# Altium schematic sheet USB-Connection.SchDoc
size A; SheetNumber: 7; SheetTotal: 8
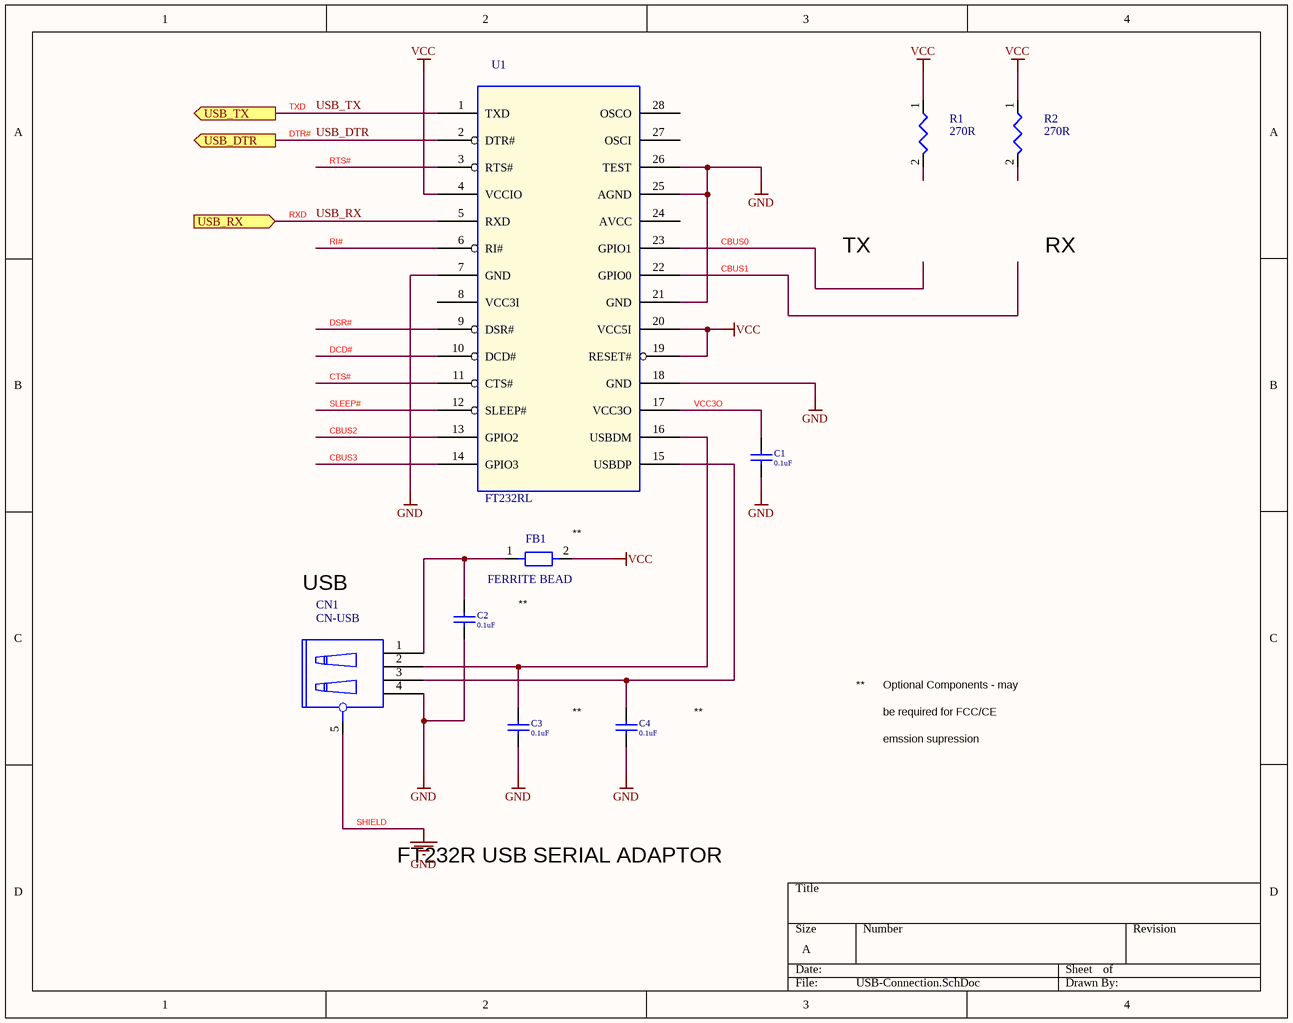
[diagram p0: USB-Connection.SchDoc]

## Parts
C1  0.1uF  [SMD 0805 CAP]
C2  0.1uF  [SMD 0805 CAP]
C3  0.1uF  [SMD 0805 CAP]
C4  0.1uF  [SMD 0805 CAP]
CN1  CN-USB  [FCI USB 61729-1011BLF]
FB1  FERRITE BEAD
R1  270R
R2  270R
U1  FT232RL  [28-SSOP]

## Ports
USB_DTR (out), USB_RX (in), USB_TX (out)

## Nets
SHIELD: C1.1 C2.1 C3.1 C4.1 CN1.4 CN1.5 U1.7(GND) U1.18(GND) U1.21(GND) U1.25(AGND) U1.26(TEST)  [also labelled GND]
VCC: FB1.2 R1.1 R2.1 U1.4(VCCIO) U1.19(RESET#) U1.20(VCC5I)
CBUS0: U1.23(GPIO1)
CBUS1: U1.22(GPIO0)
CBUS2: U1.13(GPIO2)
CBUS3: U1.14(GPIO3)
CTS#: U1.11(CTS#)
DCD#: U1.10(DCD#)
DSR#: U1.9(DSR#)
DTR#: U1.2(DTR#) ; port USB_DTR  [also labelled USB_DTR]
RI#: U1.6(RI#)
RTS#: U1.3(RTS#)
RXD: U1.5(RXD) ; port USB_RX  [also labelled USB_RX]
SLEEP#: U1.12(SLEEP#)
TXD: U1.1(TXD) ; port USB_TX  [also labelled USB_TX]
VCC3O: C1.2 U1.17(VCC3O)
NetC2_2: C2.2 CN1.1 FB1.1
NetC3_2: C3.2 CN1.2 U1.16(USBDM)
NetC4_2: C4.2 CN1.3 U1.15(USBDP)

Not connected (* = marked no-connect by the designer): R1 2; R2 2; U1 8(VCC3I) 24(AVCC) 27(OSCI) 28(OSCO)

## Notes on the sheet
- TX
- RX
- (near FB1) **
- USB
- **
- Optional Components - may
- be required for FCC/CE
- emssion supression
- FT232R USB SERIAL ADAPTOR

## Library data of the parts
C1-C4 = Cap_3: Capacitor; Published: 8-Jun-2000; LatestRevisionDate: 17-Jul-2002; LatestRevisionNote: Re-released for DXP Platform.; PackageReference: RAD-0.3; Publisher: Altium Limited; PackageDescription: Radial Cap, Thru-Hole; 2 Leads; 0.3 in Pin Spacing; Value: 0.1uF
FB1 = FB
R1 R2 = R
U1 = FT232R: USB Bridge, USB to UART USB 2.0 UART Interface 28-SSOP